# Altium schematic sheet Top.SchDoc
size A4; DocumentNumber: 3; SheetNumber: 1; SheetTotal: 5
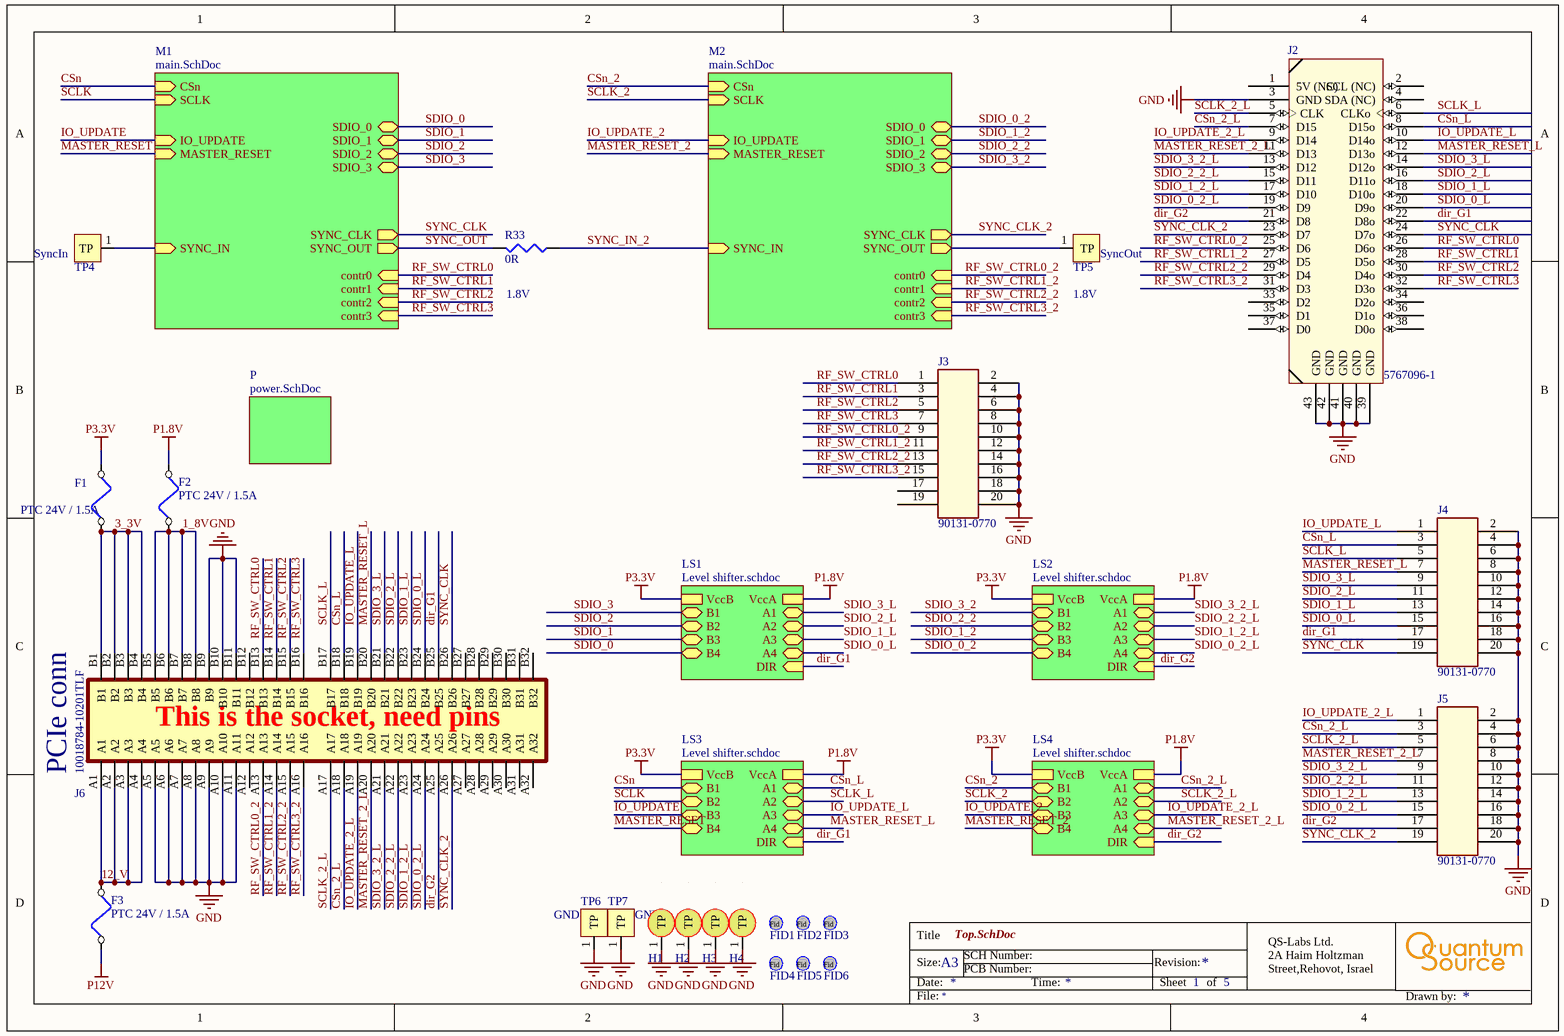
[diagram p0: Top.SchDoc]

## Parts
F1  PTC 24V / 1.5A  [1812_F]
F2  PTC 24V / 1.5A  [1812_F]
F3  PTC 24V / 1.5A  [1812_F]
FID1  Fiducial  [Fiducial]  (value not drawn)
FID2  Fiducial  [Fiducial]  (value not drawn)
FID3  Fiducial  [Fiducial]  (value not drawn)
FID4  Fiducial  [Fiducial]  (value not drawn)
FID5  Fiducial  [Fiducial]  (value not drawn)
FID6  Fiducial  [Fiducial]  (value not drawn)
H1  Hole 3mm  [hole 3mm]  (value not drawn)
H2  Hole 3mm  [hole 3mm]  (value not drawn)
H3  Hole 3mm  [hole 3mm]  (value not drawn)
H4  Hole 3mm  [hole 3mm]  (value not drawn)
J2  5767096-1  [MICTOR-38_PIN]
J3  90131-0770  [HEADER_10x2]
J4  90131-0770  [HEADER_10x2]
J5  90131-0770  [HEADER_10x2]
J6  10018784-10201TLF  [PCIE_8LANE_EDGE]
R33  0R  [R0402]
TP4  SyncIn  [TP_2x1.8]
TP5  SyncOut  [TP_2x1.8]
TP6  GND  [TP_2x1.8]
TP7  GND  [TP_2x1.8]

## Sub-sheets
LS1 = Level shifter.schdoc: A4 (bidir), B3 (bidir), A2 (bidir), B1 (bidir), B4 (bidir), A1 (bidir), B2 (bidir), A3 (bidir), VccA, VccB, DIR (in)
LS2 = Level shifter.schdoc: A4 (bidir), B3 (bidir), A2 (bidir), B1 (bidir), B4 (bidir), A1 (bidir), B2 (bidir), A3 (bidir), VccA, VccB, DIR (in)
LS3 = Level shifter.schdoc: A4 (bidir), B3 (bidir), A2 (bidir), B1 (bidir), B4 (bidir), A1 (bidir), B2 (bidir), A3 (bidir), VccA, VccB, DIR (in)
LS4 = Level shifter.schdoc: A4 (bidir), B3 (bidir), A2 (bidir), B1 (bidir), B4 (bidir), A1 (bidir), B2 (bidir), A3 (bidir), VccA, VccB, DIR (in)
M1 = main.SchDoc: SYNC_CLK (out), SYNC_OUT (out), SDIO_0 (bidir), SDIO_1 (bidir), SDIO_2 (bidir), SDIO_3 (bidir), CSn (in), IO_UPDATE (in), MASTER_RESET (in), SCLK (in), SYNC_IN (in), contr0 (in), contr1 (in), contr2 (in), contr3 (in)
M2 = main.SchDoc: SYNC_CLK (out), SYNC_OUT (out), SDIO_0 (bidir), SDIO_1 (bidir), SDIO_2 (bidir), SDIO_3 (bidir), CSn (in), IO_UPDATE (in), MASTER_RESET (in), SCLK (in), SYNC_IN (in), contr0 (in), contr1 (in), contr2 (in), contr3 (in)
P = power.SchDoc: no entries

## Nets
GND: H1.1(TP) H2.1(TP) H3.1(TP) H4.1(TP) J2.3(GND) J2.39(GND) J2.40(GND) J2.41(GND) J2.42(GND) J2.43(GND) J3.2 J3.4 J3.6 J3.8 J3.10 J3.12 J3.14 J3.16 J3.18 J3.20 J4.2 J4.4 J4.6 J4.8 J4.10 J4.12 J4.14 J4.16 J4.18 J4.20 J5.2 J5.4 J5.6 J5.8 J5.10 J5.12 J5.14 J5.16 J5.18 J5.20 J6.A5 J6.A6 J6.A7 J6.A8 J6.A9 J6.A10 J6.A11 J6.B9 J6.B10 J6.B11 TP6.1(TP) TP7.1(TP)
P1.8V: F2.2 ; sheet LS2/VccA, sheet LS1/VccA, sheet LS3/VccA, sheet LS4/VccA
P3.3V: F1.2 ; sheet LS2/VccB, sheet LS1/VccB, sheet LS3/VccB, sheet LS4/VccB
P12V: F3.1
1_8V: F2.1 J6.B5 J6.B6 J6.B7 J6.B8
3_3V: F1.1 J6.B1 J6.B2 J6.B3 J6.B4
12_V: F3.2 J6.A1 J6.A2 J6.A3 J6.A4
CSn: sheet M1/CSn, sheet LS3/B1
CSn_2: sheet M2/CSn, sheet LS4/B1
CSn_2_L: J2.7(D15) J5.3 J6.A18 ; sheet LS4/A1
CSn_L: J2.8(D15o) J4.3 J6.B18 ; sheet LS3/A1
dir_G1: J2.22(D8o) J4.17 J6.B25 ; sheet LS1/DIR, sheet LS3/DIR
dir_G2: J2.21(D8) J5.17 J6.A25 ; sheet LS2/DIR, sheet LS4/DIR
IO_UPDATE: sheet M1/IO_UPDATE, sheet LS3/B3
IO_UPDATE_2: sheet M2/IO_UPDATE, sheet LS4/B3
IO_UPDATE_2_L: J2.9(D14) J5.1 J6.A19 ; sheet LS4/A3
IO_UPDATE_L: J2.10(D14o) J4.1 J6.B19 ; sheet LS3/A3
MASTER_RESET: sheet M1/MASTER_RESET, sheet LS3/B4
MASTER_RESET_2: sheet M2/MASTER_RESET, sheet LS4/B4
MASTER_RESET_2_L: J2.11(D13) J5.7 J6.A20 ; sheet LS4/A4
MASTER_RESET_L: J2.12(D13o) J4.7 J6.B20 ; sheet LS3/A4
RF_SW_CTRL0: J2.26(D6o) J3.1 J6.B13 ; sheet M1/contr0
RF_SW_CTRL0_2: J2.25(D6) J3.9 J6.A13 ; sheet M2/contr0
RF_SW_CTRL1: J2.28(D5o) J3.3 J6.B14 ; sheet M1/contr1
RF_SW_CTRL1_2: J2.27(D5) J3.11 J6.A14 ; sheet M2/contr1
RF_SW_CTRL2: J2.30(D4o) J3.5 J6.B15 ; sheet M1/contr2
RF_SW_CTRL2_2: J2.29(D4) J3.13 J6.A15 ; sheet M2/contr2
RF_SW_CTRL3: J2.32(D3o) J3.7 J6.B16 ; sheet M1/contr3
RF_SW_CTRL3_2: J2.31(D3) J3.15 J6.A16 ; sheet M2/contr3
SCLK: sheet M1/SCLK, sheet LS3/B2
SCLK_2: sheet M2/SCLK, sheet LS4/B2
SCLK_2_L: J2.5(CLK) J5.5 J6.A17 ; sheet LS4/A2
SCLK_L: J2.6(CLKo) J4.5 J6.B17 ; sheet LS3/A2
SDIO_0: sheet M1/SDIO_0, sheet LS1/B4
SDIO_0_2: sheet M2/SDIO_0, sheet LS2/B4
SDIO_0_2_L: J2.19(D9) J5.15 J6.A24 ; sheet LS2/A4
SDIO_0_L: J2.20(D9o) J4.15 J6.B24 ; sheet LS1/A4
SDIO_1: sheet M1/SDIO_1, sheet LS1/B3
SDIO_1_2: sheet M2/SDIO_1, sheet LS2/B3
SDIO_1_2_L: J2.17(D10) J5.13 J6.A23 ; sheet LS2/A3
SDIO_1_L: J2.18(D10o) J4.13 J6.B23 ; sheet LS1/A3
SDIO_2: sheet M1/SDIO_2, sheet LS1/B2
SDIO_2_2: sheet M2/SDIO_2, sheet LS2/B2
SDIO_2_2_L: J2.15(D11) J5.11 J6.A22 ; sheet LS2/A2
SDIO_2_L: J2.16(D11o) J4.11 J6.B22 ; sheet LS1/A2
SDIO_3: sheet M1/SDIO_3, sheet LS1/B1
SDIO_3_2: sheet M2/SDIO_3, sheet LS2/B1
SDIO_3_2_L: J2.13(D12) J5.9 J6.A21 ; sheet LS2/A1
SDIO_3_L: J2.14(D12o) J4.9 J6.B21 ; sheet LS1/A1
SYNC_CLK: J2.24(D7o) J4.19 J6.B26 ; sheet M1/SYNC_CLK
SYNC_CLK_2: J2.23(D7) J5.19 J6.A26 ; sheet M2/SYNC_CLK
SYNC_IN_2: R33.1 ; sheet M2/SYNC_IN
SYNC_OUT: R33.2 ; sheet M1/SYNC_OUT
NetTP4_1: TP4.1(TP) ; sheet M1/SYNC_IN
NetTP5_1: TP5.1(TP) ; sheet M2/SYNC_OUT

Not connected (* = marked no-connect by the designer): J2 1(5V_(NC)) 2(SCL_(NC)) 4(SDA_(NC)) 33(D2) 34(D2o) 35(D1) 36(D1o) 37(D0) 38(D0o); J3 17 19; J6 A12 A27 A28 A29 A30 A31 A32 B12 B27 B28 B29 B30 B31 B32

## Notes on the sheet
- (near R33) 1.8V
- (near TP5) 1.8V
- (near J6) PCIe conn
- (near J6) This is the socket, need pins
- Title
- Size:
- Date:
- A3
- PCB Number:
- SCH Number:
- Time:
- Revision:
- Sheet
- of
- QS-Labs Ltd.
  2A Haim Holtzman Street,Rehovot, Israel
- File:
- Drawn by:
- (in symbol Fiducial) Fid

## Library data of the parts
F1-F3 = 1812L150/24MR: FUSE PTC 24V 1.5A POLYFUSE 1812; Manufacturer: Littelfuse Inc; LANDA P/N: EFS-000011; Package / Case: 1812 (4532 Metric), Concave; RoHS: RoHS Compliant; Manufacturer Part Number: 1812L150/24MR; ComponentLink1URL: http://www.littelfuse.com/data/en/Data_Sheets/Littelfuse_PTC_1812L.pdf; ComponentLink1Description: http://www.littelfuse.com/data/en/Data_Sheets/Littelfuse_PTC_1812L.pdf; Current - Hold (Ih) (Max): 1.5A
FID1-FID6 = Fiducial: Assembly: NA
J2 = 5767096-1: CONN MICTOR 38POS .025 VERT SMD; Manufacturer: TE Connectivity; LANDA P/N: ECN-000060; RoHS: RoHS Compliant; ComponentLink1URL: http://www.te.com/commerce/DocumentDelivery/DDEController?Action=srchrtrv&DocNm=5767096&DocType=Customer+Drawing&DocLang=English; ComponentLink1Description: http://www.te.com/commerce/DocumentDelivery/DDEController?Action=srchrtrv&DocNm=5767096&DocType=Customer+Drawing&DocLang=English; Manufacturer Part Number: 5767096-1
J3-J5 = 90131-0770: CONN HEADER 20 TH; Manufacturer: Molex Connector Corporation; LANDA P/N: ECN-000005; RoHS: RoHS Compliant; Mounting Type: Through Hole; Contact Type: Male Pin; ComponentLink1URL: http://www.molex.com/pdm_docs/sd/901310770_sd.pdf; ComponentLink1Description: http://www.molex.com/pdm_docs/sd/901310770_sd.pdf; Manufacturer Part Number: 90131-0770
J6 = 10018784-10201TLF: 64 Position Female Connector PCI Expressâ„¢ Gold 0.039 _1.00mm_ Black; MF: Amphenol ICC; Price: None; Value: *; MP: 10018784-10201TLF; Package: None; SnapEDA_Link: https://www.snapeda.com/parts/10018784-10201TLF/Amphenol%20FCI/view-part/2598016/?ref=snap; Availability: Unavailable
R33 = RES 100 OHM 1/10W 1% 0402 SMD: RES 0 OHM 1/10W 1% 0402 SMD; Manufacturer Part Number: ERJ-2RKF1000X; Manufacturer: Panasonic Electronic Components; LANDA P/N: ERS-000079; Assembly: N.C; Package / Case: 0402 (1005 Metric); RoHS: RoHS Compliant; ComponentLink1URL: http://industrial.panasonic.com/www-cgi/jvcr13pz.cgi?E+PZ+3+AOA0002+ERJ2RKF1000X+7+WW; ComponentLink1Description: http://industrial.panasonic.com/www-cgi/jvcr13pz.cgi?E+PZ+3+AOA0002+ERJ2RKF1000X+7+WW; Supplier Device Package: 0402
TP4-TP6 = TP mini_2: TP PC MINIATURE SMT; Manufacturer: Keystone Electronics; Manufacturer Part Number: 5015; Assembly: N.A; LANDA P/N: ECN-000032; RoHS: RoHS Compliant
TP7 = TP mini_1: TP PC MINIATURE SMT; Manufacturer: Keystone Electronics; Manufacturer Part Number: 5015; Assembly: N.A; LANDA P/N: ECN-000032; RoHS: RoHS Compliant